# EAGLE design bluetooth_RGB (EAGLE 6.5.0)
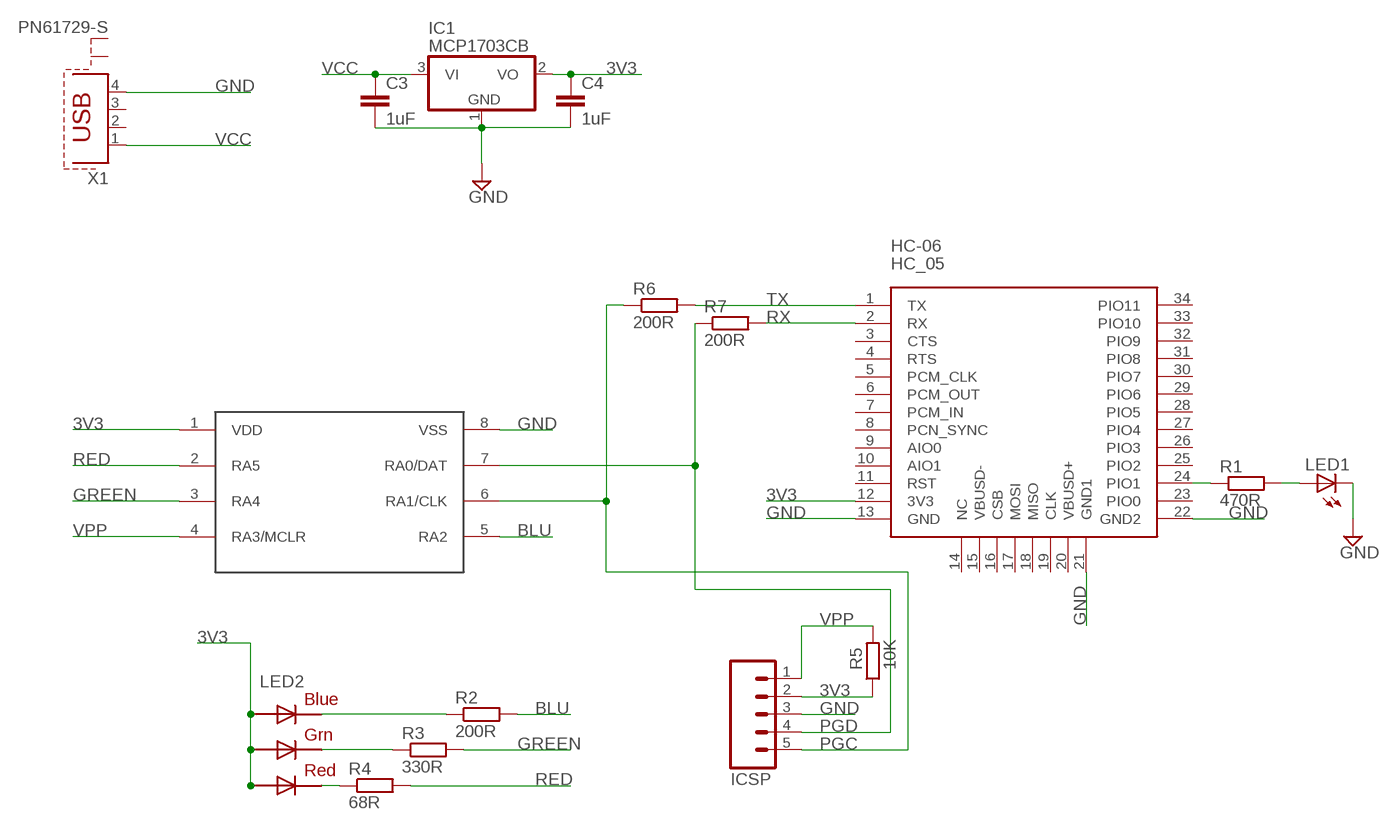
[diagram p0: schematic, sheet 1]

## Parts
C3  1uF  CAP0805  [0805]
C4  1uF  CAP0805  [0805]
HC-06  HC_05  [BLUETOOTH_SMD]
IC1  MCP1703CB  [SOT23]
ICSP  M05PTH  [1X05]
LED1  LEDCHIPLED_0805  [CHIPLED_0805]
LED2  RGBLED5050  [RGBLED5050]
R1  470R  R-EU_M0805  [M0805]
R2  200R  R-EU_M0805  [M0805]
R3  330R  R-EU_M0805  [M0805]
R4  68R  R-EU_M0805  [M0805]
R5  10K  R-EU_M0805  [M0805]
R6  200R  R-EU_R0805  [R0805]
R7  200R  R-EU_R0805  [R0805]
U2  PIC12F1572  [MSOP8]
X1  PN61729-S  [PN61729-S]

## Nets
3V3: C4.1 HC-06.12(3V3) IC1.2(VO) ICSP.2 LED2.1(GREEN_A) LED2.2(RED_A) LED2.3(BLUE_A) R5.1 U2.1(VDD)
BLU: R2.2 U2.5(RA2)
GND: C3.2 C4.2 HC-06.13(GND) HC-06.21(GND1) HC-06.22(GND2) IC1.1(GND) ICSP.3 LED1.C U2.8(VSS) X1.4
GREEN: R3.2 U2.3(RA4)
N$1: LED2.4(BLUE_C) R2.1
N$2: LED1.A R1.2
N$3: HC-06.24(PIO1) R1.1
N$4: LED2.6(GREEN_C) R3.1
N$5: LED2.5(RED_C) R4.1
PGC: ICSP.5 R6.1 U2.6(RA1/CLK)
PGD: ICSP.4 R7.1 U2.7(RA0/DAT)
RED: R4.2 U2.2(RA5)
RX: HC-06.2(RX) R7.2
TX: HC-06.1(TX) R6.2
VCC: C3.1 IC1.3(VI) X1.1
VPP: ICSP.1 R5.2 U2.4(RA3/MCLR)
Unconnected: HC-06.3(CTS) HC-06.4(RTS) HC-06.5(PCM_CLK) HC-06.6(PCM_OUT) HC-06.7(PCM_IN) HC-06.8(PCN_SYNC) HC-06.9(AIO0) HC-06.10(AIO1) HC-06.11(RST) HC-06.14(NC) HC-06.15(VBUSD-) HC-06.16(CSB) HC-06.17(MOSI) HC-06.18(MISO) HC-06.19(CLK) HC-06.20(VBUSD+) HC-06.23(PIO0) HC-06.25(PIO2) HC-06.26(PIO3) HC-06.27(PIO4) HC-06.28(PIO5) HC-06.29(PIO6) HC-06.30(PIO7) HC-06.31(PIO8) HC-06.32(PIO9) HC-06.33(PIO10) HC-06.34(PIO11) X1.2 X1.3 X1.S1 X1.S2

## Library data of the parts
C3 C4 = SparkFun-Passives:CAP: Capacitor Standard 0603 ceramic capacitor, and 0.1" leaded capacitor.
HC-06 = SerialPortBluetooth:HC_05
IC1 = linear:MCP1703: 250 mA, 16V, Low Quiescent Current LDO Regulator Source: http://ww1.microchip.com/downloads/en/DeviceDoc/22049b.pdf
ICSP = SparkFun-Connectors:M05: Header 5 Standard 5-pin 0.1" header. Use with straight break away headers (SKU : PRT-00116), right angle break away headers (PRT-00553), swiss pins (PRT-00743), machine pins (PRT-00117), and female headers (PRT-00115). Molex polarized connector foot print use with SKU : PRT-08230 with associated crimp pins and housings.
LED1 = adafruit:LED: LED OSRAM: - CHIPLED LG R971, LG N971, LY N971, LG Q971, LY Q971, LO R971, LY R971 LH N974, LH R974 LS Q976, LO Q976, LY Q976 LO Q996 - Hyper CHIPLED LW Q18S LB Q993, LB Q99A, LB R99A - SideLED LS A670, LO A670, LY A670, LG A670, LP A670 LB A673, LV A673, LT A673, LW A673 LH A674 LY A675 LS A676, LA A676, LO A676, LY A676, LW A676 LS A679, LY A679, LG A679 - Hyper Micro SIDELED® LS Y876, LA Y876, LO Y876, LY Y876 LT Y87S - SmartLED LW L88C, LW L88S LB L89C, LB L89S, LG L890 LS L89K, LO L89K, LY L89K LS L896, LA L896, LO L896, LY L896 - TOPLED LS T670, LO T670, LY T670, LG T670, LP T670 LSG T670, LSP T670, LSY T670, LOP T670, LYG T670 LG T671, LOG T671, LSG T671 LB T673, LV T673, LT T673, LW T673 LH T674 LS T676, LA T676, LO T676, LY T676, LB T676, LH T676, LSB T676, LW T676 LB T67C, LV T67C, LT T67C, LS T67K, LO T67K, LY T67K, LW E67C LS E67B, LA E67B, LO E67B, LY E67B, LB E67C, LV E67C, LT E67C LW T67C LS T679, LY T679, LG T679 LS T770, LO T770, LY T770, LG T770, LP T770 LB T773, LV T773, LT T773, LW T773 LH T774 LS E675, LA E675, LY E675, LS T675 LS T776, LA T776, LO T776, LY T776, LB T776 LHGB T686 LT T68C, LB T68C - Hyper Mini TOPLED® LB M676 - Mini TOPLED Santana® LG M470 LS M47K, LO M47K, LY M47K Source: http://www.osram.convergy.de/
LED2 = adafruit:RGBLED: For 5050 RGB LEDs, the order of the LEDs may vary from one manufacturer to another!
R1-R7 = rcl:R-EU_: RESISTOR, European symbol
U2 = microchip:PIC12F1572
X1 = con-berg:PN61729-S: BERG USB connector; OC_FARNELL: unknown; OC_NEWARK: unknown

## Board
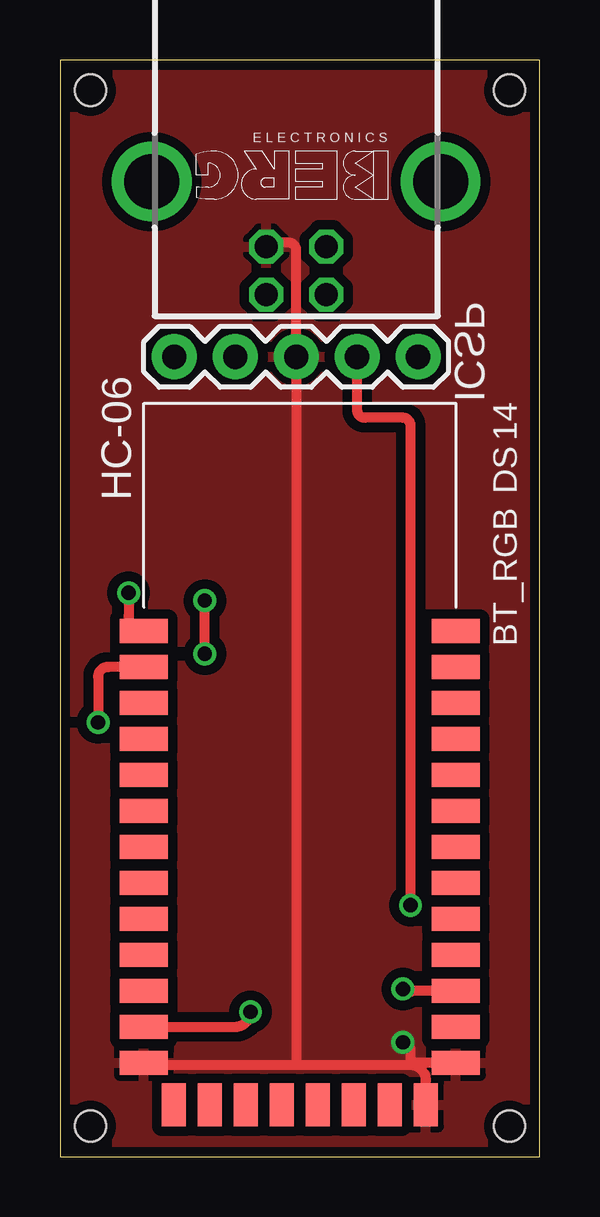
[diagram p1: board, top side]
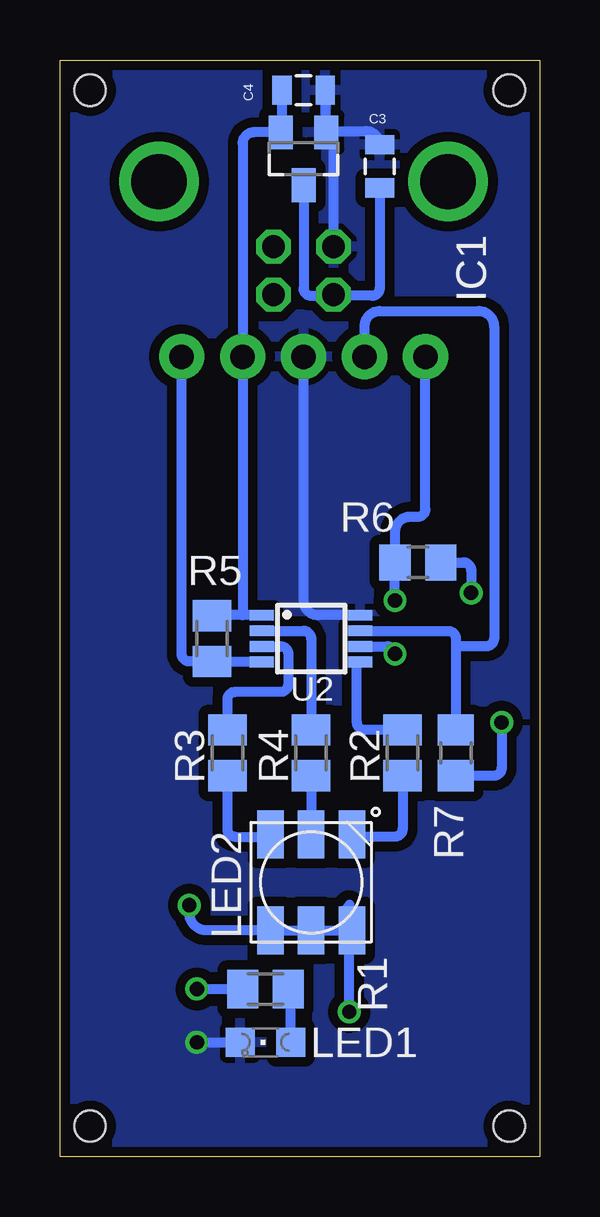
[diagram p2: board, bottom side, seen from below]

Size 19.99 x 45.71 mm. Coordinates in mm from the lower left corner, seen from the top.
Outline: 0,0 19.99,0 19.99,45.71 0,45.71 0,0
Copper layers (1*16): Top 0.0356mm / dielectric 1.5011mm / Bottom 0.0356mm
Design rules "LaenPCBOrder": minimum track width 6mil, minimum drill 13mil, track to track 6mil, track to pad 6mil, pad to pad 6mil, via to via 6mil, smd to smd 6mil, copper to edge 15mil, drill to drill 6mil, minimum pad ring 7mil, minimum via ring 7mil, stop-mask expansion 3mil, vias tented up to drill 0mil, thermal gap 10mil
Holes 1.3 mm at 1.27,44.45 18.73,44.45 18.73,1.27 1.27,1.27

### Footprints (pad centres in the part's own frame; a part is rotated, then mirrored left to right if it is on the bottom)
0805 = smd 0.8 x 1.2: 1 -0.9,0; 2 0.9,0
BLUETOOTH_SMD = smd 2 x 1: 1 0,0; 2 0,-1.5; 3 0,-3; 4 0,-4.5; 5 0,-6; 6 0,-7.5; 7 0,-9; 8 0,-10.5; 9 0,-12; 10 0,-13.5; 11 0,-15; 12 0,-16.5; 13 0,-18; 22 13,-18; 23 13,-16.5; 24 13,-15; 25 13,-13.5; 26 13,-12; 27 13,-10.5; 28 13,-9; 29 13,-7.5; 30 13,-6; 31 13,-4.5; 32 13,-3; 33 13,-1.5; 34 13,0 | smd 1 x 1.8: 14 1.25,-19.75; 15 2.75,-19.75; 16 4.25,-19.75; 17 5.75,-19.75; 18 7.25,-19.75; 19 8.75,-19.75; 20 10.25,-19.75; 21 11.75,-19.75
SOT23 = smd 1 x 1.4: 1 -0.95,-1.1; 2 0.95,-1.1; 3 0,1.1
1X05 = drill 1.016 pad 1.88: 1 0,0; 2 2.54,0; 3 5.08,0; 4 7.62,0; 5 10.16,0
CHIPLED_0805 = smd 1.2 x 1.2: A 0,-1.05; C 0,1.05
RGBLED5050 = smd 2 x 1.1: 1 -2,1.7; 2 -2,0; 3 -2,-1.7; 4 2,-1.7; 5 2,0; 6 2,1.7
M0805 = smd 1.3 x 1.6: 1 -0.95,0; 2 0.95,0
R0805 = smd 1.3 x 1.5: 1 -0.95,0; 2 0.95,0
MSOP8 = smd 0.45 x 1: 1 -0.975,-2.05; 2 -0.325,-2.05; 3 0.325,-2.05; 4 0.975,-2.05; 5 0.975,2.05; 6 0.325,2.05; 7 -0.325,2.05; 8 -0.975,2.05
PN61729-S = drill 0.95 octagon: 1 1.25,4.71; 2 -1.25,4.71; 3 -1.25,2.71; 4 1.25,2.71 | drill 2.3 pad 2.9: S1 -6.02,0; S2 6.02,0

### Placement (x,y rotation side)
C3  6.67,41.27 90 bottom
C4  9.84,44.45 0 bottom
HC-06  3.49,21.91 0 top
IC1  9.84,41.59 180 bottom
ICSP  14.92,33.34 180 top
LED1  11.43,4.76 90 bottom
LED2  9.52,11.43 90 bottom
R1  11.43,6.98 0 bottom
R2  5.71,16.83 90 bottom
R3  13.02,16.83 90 bottom
R4  9.52,16.83 90 bottom
R5  13.65,21.59 270 bottom
R6  5.08,24.77 0 bottom
R7  3.49,16.83 270 bottom
U2  9.52,21.59 270 bottom
X1  9.84,40.64 180 top

### Tracks (layer width: path | path; a pad name or v marks a point on that pad's centre or on a via)
3V3  (via drill 0.6)
  Top 0.406: HC-06.12 7.31,5.41 arc90 v7.94,6.03 | v14.61,10.48 14.61,30.48 arc90 14.29,30.8 12.7,30.8 arc-90 12.38,31.12 ICSP.2
  Bottom 0.406: C4.1 10.74,42.74 arc90 IC1.2 11.92,42.69 arc-90 12.38,42.23 ICSP.2 12.38,22.57 | U2.1 12.38,22.57 | 12.38,22.57 13.63,22.57 arc-90 R5.1 | v7.94,6.03 7.94,10.5 arc-90 LED2.3 LED2.2 LED2.1 13.88,9.43 arc90 14.61,10.16 v14.61,10.48
BLU
  Bottom 0.406: R2.2 7.3,17.78 arc90 7.62,18.1 7.62,20.47 arc90 U2.5
GND  (via drill 0.6)
  Top 0.406: X1.4 arc-90 8.76,38.1 9.52,38.1 arc-90 9.84,37.78 ICSP.3 arc-90 9.84,33.02 9.84,3.81 | 14.61,3.81 9.84,3.81 | 9.84,3.81 3.59,3.81 arc-90 HC-06.13 | 14.61,3.81 14.61,4.45 arc90 v14.29,4.76 | HC-06.21 15.24,3.17 arc90 14.61,3.81 | HC-06.22 14.7,3.91 arc90 14.61,3.81
  Bottom 0.406: C4.2 8.94,42.74 | 8.94,42.74 arc-90 IC1.1 arc90 8.59,42.39 X1.4 | 8.94,42.74 7.23,42.74 arc90 C3.2 | v14.29,4.76 LED1.C | U2.8 9.23,22.57 arc90 9.84,23.18 ICSP.3
  pour Top (isolate 0.406): 0.32,45.4 19.69,45.4 19.69,0.32 0.32,0.32
  pour Bottom (isolate 0.406): 0.32,0.32 19.69,0.32 19.69,45.4 0.32,45.4
GREEN
  Bottom 0.406: U2.3 10.79,21.27 arc90 10.48,20.96 10.48,19.68 arc90 10.8,19.37 12.7,19.37 arc-90 13.02,19.05 R3.2
N$1
  Bottom 0.406: R2.1 5.71,13.65 arc90 6.03,13.34 7.73,13.34 arc90 LED2.4
N$2
  Bottom 0.406: LED1.A 10.38,6.88 arc-90 R1.2
N$3  (via drill 0.6)
  Top 0.406: HC-06.24 14.68,6.91 arc-90 v14.29,6.98
  Bottom 0.406: v14.29,6.98 R1.1
N$4
  Bottom 0.406: R3.1 13.02,13.65 arc-90 12.7,13.34 11.64,13.34 arc-90 LED2.6
N$5
  Bottom 0.406: R4.1 9.52,13.75 arc90 LED2.5
PGC  (via drill 0.6)
  Top 0.406: v6.03,20.96 v6.03,23.18
  Bottom 0.406: U2.6 6.34,21.27 arc90 v6.03,20.96 | v6.03,23.18 R6.1 arc90 R6.1 6.03,26.04 arc90 5.4,26.67 5.08,26.67 arc-90 4.76,26.99 ICSP.5
PGD
  Bottom 0.406: U2.7 7.47,21.91 3.81,21.91 arc90 3.49,21.59 3.49,21.27 | 3.49,21.27 R7.1 | ICSP.4 7.3,34.61 arc90 6.67,35.24 2.54,35.24 arc90 1.91,34.61 1.91,21.59 arc90 2.22,21.27 3.49,21.27
RED
  Bottom 0.406: U2.2 9.85,21.91 arc90 9.52,21.59 R4.2
RX  (via drill 0.6)
  Top 0.406: HC-06.2 1.99,20.41 arc90 1.59,20 v1.59,18.1
  Bottom 0.406: v1.59,18.1 1.59,16.19 arc90 1.91,15.87 R7.2 arc90 R7.2
TX  (via drill 0.6)
  Top 0.406: v2.86,23.5 2.86,22.54 arc90 HC-06.1
  Bottom 0.406: R6.2 3.18,24.77 arc90 2.86,24.45 v2.86,23.5
VCC
  Bottom 0.406: IC1.3 9.84,36.2 arc-90 9.52,35.88 8.65,35.88 arc-90 X1.1 arc-90 8.54,35.88 6.98,35.88 arc-90 6.67,36.2 C3.1
VPP
  Bottom 0.406: U2.4 13.63,20.62 arc90 R5.2 14.61,20.64 arc90 14.92,20.96 ICSP.1

### Text on the board
tNames: 14 | DS | BT_RGB